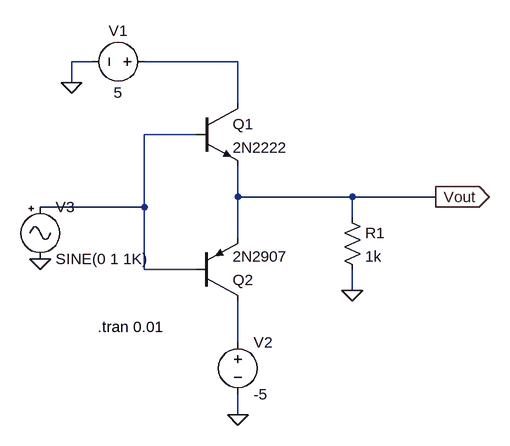
[diagram p0: schematic TEST7.asc]
TEST7.asc, the LTspice schematic file:
Version 4
SHEET 1 880 680
WIRE 208 96 176 96
WIRE 432 96 288 96
WIRE 176 128 176 96
WIRE 432 160 432 96
WIRE 368 208 288 208
WIRE 432 304 432 256
WIRE 608 304 432 304
WIRE 736 304 608 304
WIRE 288 320 288 208
WIRE 288 320 128 320
WIRE 608 336 608 304
WIRE 432 368 432 304
WIRE 288 416 288 320
WIRE 368 416 288 416
WIRE 608 448 608 416
WIRE 432 528 432 464
WIRE 432 640 432 608
FLAG 608 448 0
FLAG 432 640 0
FLAG 176 128 0
FLAG 736 304 Vout
IOPIN 736 304 Out
FLAG 128 400 0
SYMBOL voltage 304 96 R90
WINDOW 0 -32 56 VBottom 2
WINDOW 3 32 56 VTop 2
SYMATTR InstName V1
SYMATTR Value 5
SYMBOL npn 368 160 R0
SYMATTR InstName Q1
SYMATTR Value 2N2222
SYMBOL pnp 368 464 M180
SYMATTR InstName Q2
SYMATTR Value 2N2907
SYMBOL res 592 320 R0
SYMATTR InstName R1
SYMATTR Value 1k
SYMBOL voltage 432 512 R0
SYMATTR InstName V2
SYMATTR Value -5
SYMBOL Misc/signal 128 304 R0
SYMATTR InstName V3
TEXT 216 504 Left 2 !.tran 0.01

The netlist it stands for:
* TEST7.asc
V1 N001 0 5
Q1 N001 N002 Vout 0 2N2222
Q2 N003 N002 Vout 0 2N2907
R1 Vout 0 1k
V2 N003 0 -5
V3 N002 0 SINE(0 1 1K)
.model NPN NPN
.model PNP PNP
.lib standard.bjt
.tran 0.01
.backanno
.end